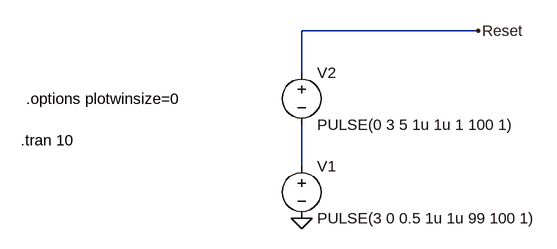
[diagram p0: schematic EasyDoubleResetSignals.asc]
EasyDoubleResetSignals.asc, the LTspice schematic file:
Version 4
SHEET 1 880 680
WIRE 352 -32 80 -32
WIRE 80 32 80 -32
WIRE 80 176 80 112
FLAG 80 256 0
FLAG 352 -32 Reset
SYMBOL voltage 80 160 R0
WINDOW 123 0 0 Left 2
WINDOW 39 0 0 Left 2
SYMATTR InstName V1
SYMATTR Value PULSE(3 0 0.5 1u 1u 99 100 1)
SYMBOL voltage 80 16 R0
WINDOW 123 0 0 Left 2
WINDOW 39 0 0 Left 2
SYMATTR InstName V2
SYMATTR Value PULSE(0 3 5 1u 1u 1 100 1)
TEXT -352 136 Left 2 !.tran 10
TEXT -344 72 Left 2 !.options plotwinsize=0

The netlist it stands for:
* EasyDoubleResetSignals.asc
V1 N001 0 PULSE(3 0 0.5 1u 1u 99 100 1)
V2 Reset N001 PULSE(0 3 5 1u 1u 1 100 1)
.tran 10
.options plotwinsize=0
.backanno
.end